# EAGLE design ad8495Amp (EAGLE 7.4.0)
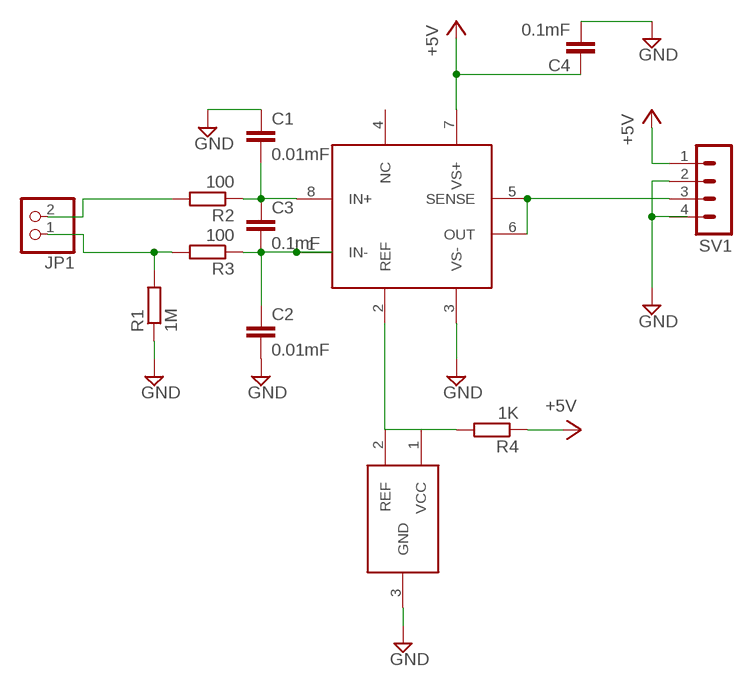
[diagram p0: schematic, sheet 1]

## Parts
C1  0.01mF  C-EUC1206  [C1206]
C2  0.01mF  C-EUC1206  [C1206]
C3  0.1mF  C-EUC1206  [C1206]
C4  0.1mF  C-EUC1206  [C1206]
JP1  PINHD-1X2  [1X02]
R1  1M  R-EU_R1206  [R1206]
R2  100  R-EU_R1206  [R1206]
R3  100  R-EU_R1206  [R1206]
R4  1K  R-EU_R1206  [R1206]
SV1  MA04-1  [MA04-1]
U$1  AD8495MSOP8  [MSOP8]
U$2  TLVH431TLVH431  [SOT23-R]

## Nets
+5V: C4.1 R4.1 SV1.1 U$1.7(VS+)
GND: C1.1 C2.2 C4.2 R1.1 SV1.2 U$1.3(VS-) U$2.3(GND)
N$2: C2.1 C3.2 R3.1 U$1.1(IN-)
N$3: C1.2 C3.1 R2.1 U$1.8(IN+)
N$4: SV1.3 U$1.5(SENSE) U$1.6(OUT)
N$5: JP1.2 R2.2
N$6: R4.2 U$1.2(REF) U$2.1(VCC) U$2.2(REF)
N$7: JP1.1 R1.2 R3.2
Unconnected: SV1.4 U$1.4(NC)

## Library data of the parts
C1-C4 = rcl:C-EU: CAPACITOR, European symbol
JP1 = pinhead:PINHD-1X2: PIN HEADER
R1-R4 = resistor:R-EU_: RESISTOR, European symbol
SV1 = con-lstb:MA04-1: PIN HEADER; OC_FARNELL: unknown; OC_NEWARK: unknown
U$1 = mylib:AD8495
U$2 = mylib:TLVH431

## Board
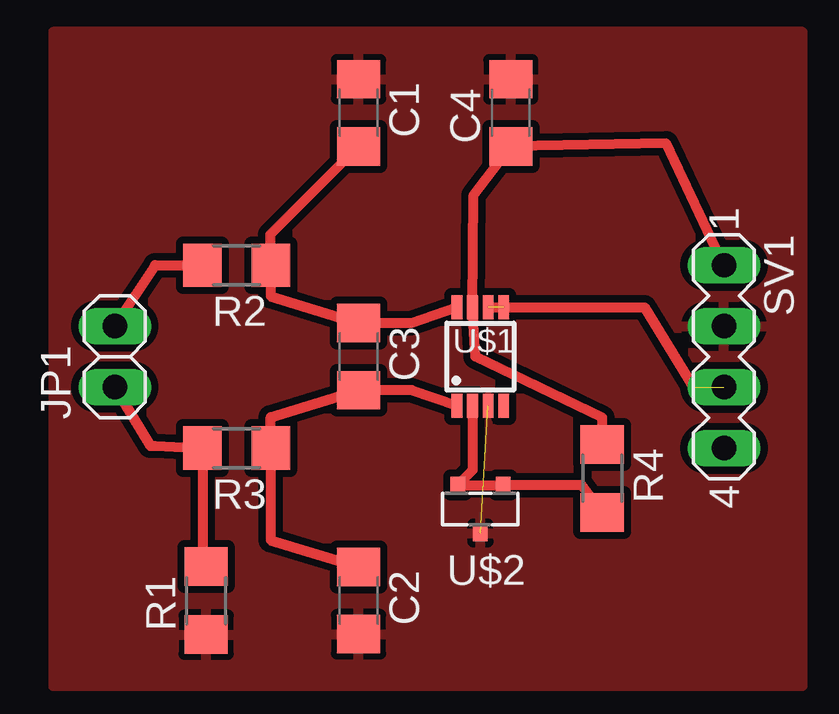
[diagram p1: board, top side]

No outline drawn. Coordinates in mm, seen from the top.
Copper layers (1*16): Top 0.035mm / dielectric 1.5mm / Bottom 0.035mm
Design rules "default": minimum track width 10mil, minimum drill 24mil, track to track 8mil, track to pad 8mil, pad to pad 8mil, via to via 8mil, smd to smd 8mil, copper to edge 40mil, drill to drill 8mil, minimum pad ring 10mil, minimum via ring 8mil, stop-mask expansion 4mil, vias tented up to drill 0mil, thermal gap 10mil

### Footprints (pad centres in the part's own frame; a part is rotated, then mirrored left to right if it is on the bottom)
C1206 = smd 1.6 x 1.8: 1 -1.4,0; 2 1.4,0
1X02 = drill 1.016 long: 1 -1.27,0; 2 1.27,0
R1206 = smd 1.6 x 1.803: 1 -1.422,0; 2 1.422,0
MA04-1 = drill 1.016 long: 1 -3.81,0; 2 -1.27,0; 3 1.27,0; 4 3.81,0
MSOP8 = smd 0.45 x 1: 1 -0.975,-2.05; 2 -0.325,-2.05; 3 0.325,-2.05; 4 0.975,-2.05; 5 0.975,2.05; 6 0.325,2.05; 7 -0.325,2.05; 8 -0.975,2.05
SOT23-R = smd 0.6 x 0.7: 1 -0.95,-1; 2 0.95,-1; 3 0,1

### Placement (x,y rotation side)
C1  13.48,24.13 270 top
C2  13.48,3.81 270 top
C3  13.48,13.97 270 top
C4  19.83,24.13 90 top
JP1  3.32,13.97 90 top
R1  7.13,3.81 90 top
R2  8.4,17.78 180 top
R3  8.4,10.16 180 top
R4  23.64,8.89 270 top
SV1  28.72,13.97 270 top
U$1  18.56,13.97 0 top
U$2  18.56,7.62 180 top

### Tracks (layer width: path | path; a pad name or v marks a point on that pad's centre or on a via)
+5V
  Top 0.406: SV1.1 26.31,22.86 C4.1 18.28,20.7 U$1.7 18.36,13.97 23.64,11.43 R4.1 23.64,10.16
GND  (1 unrouted)
  pour Top (isolate 0.305): 0.75,27.5 0.75,0.25 32,0.25 32,27.5
N$2
  Top 0.406: U$1.1 15.7,12.57 C3.2 9.82,11.45 R3.1 9.82,6.33 C2.1
N$3
  Top 0.406: C1.2 9.8,19.05 R2.1 9.82,16.49 C3.1 15.66,15.37 U$1.8
N$4  (2 unrouted)
  Top 0.406: U$1.6 25.4,16.02 27.45,12.7
N$5
  Top 0.406: JP1.2 5,17.75 5,17.78 R2.2
N$6
  Top 0.406: R4.2 22.79,8.62 U$2.1 U$2.2 18.23,9.24 U$1.2
N$7
  Top 0.406: JP1.1 4.8,10.25 5,10.25 R3.2 6.98,5.38 R1.2

### Text on the board
_tNames: C1 | C1 | C1 | C4 | C4 | C4 | SV1 | SV1 | SV1 | R2 | R2 | R2 | C3 | C3 | C3 | U$1 | U$1 | U$1 | JP1 | JP1 | JP1 | R4 | R4 | R4 | R3 | R3 | R3 | U$2 | U$2 | U$2 | C2 | C2 | C2 | R1 | R1 | R1